# EAGLE design 06_SBCStage_v1 (EAGLE 9.6.2)

## Sheet 1 of 2
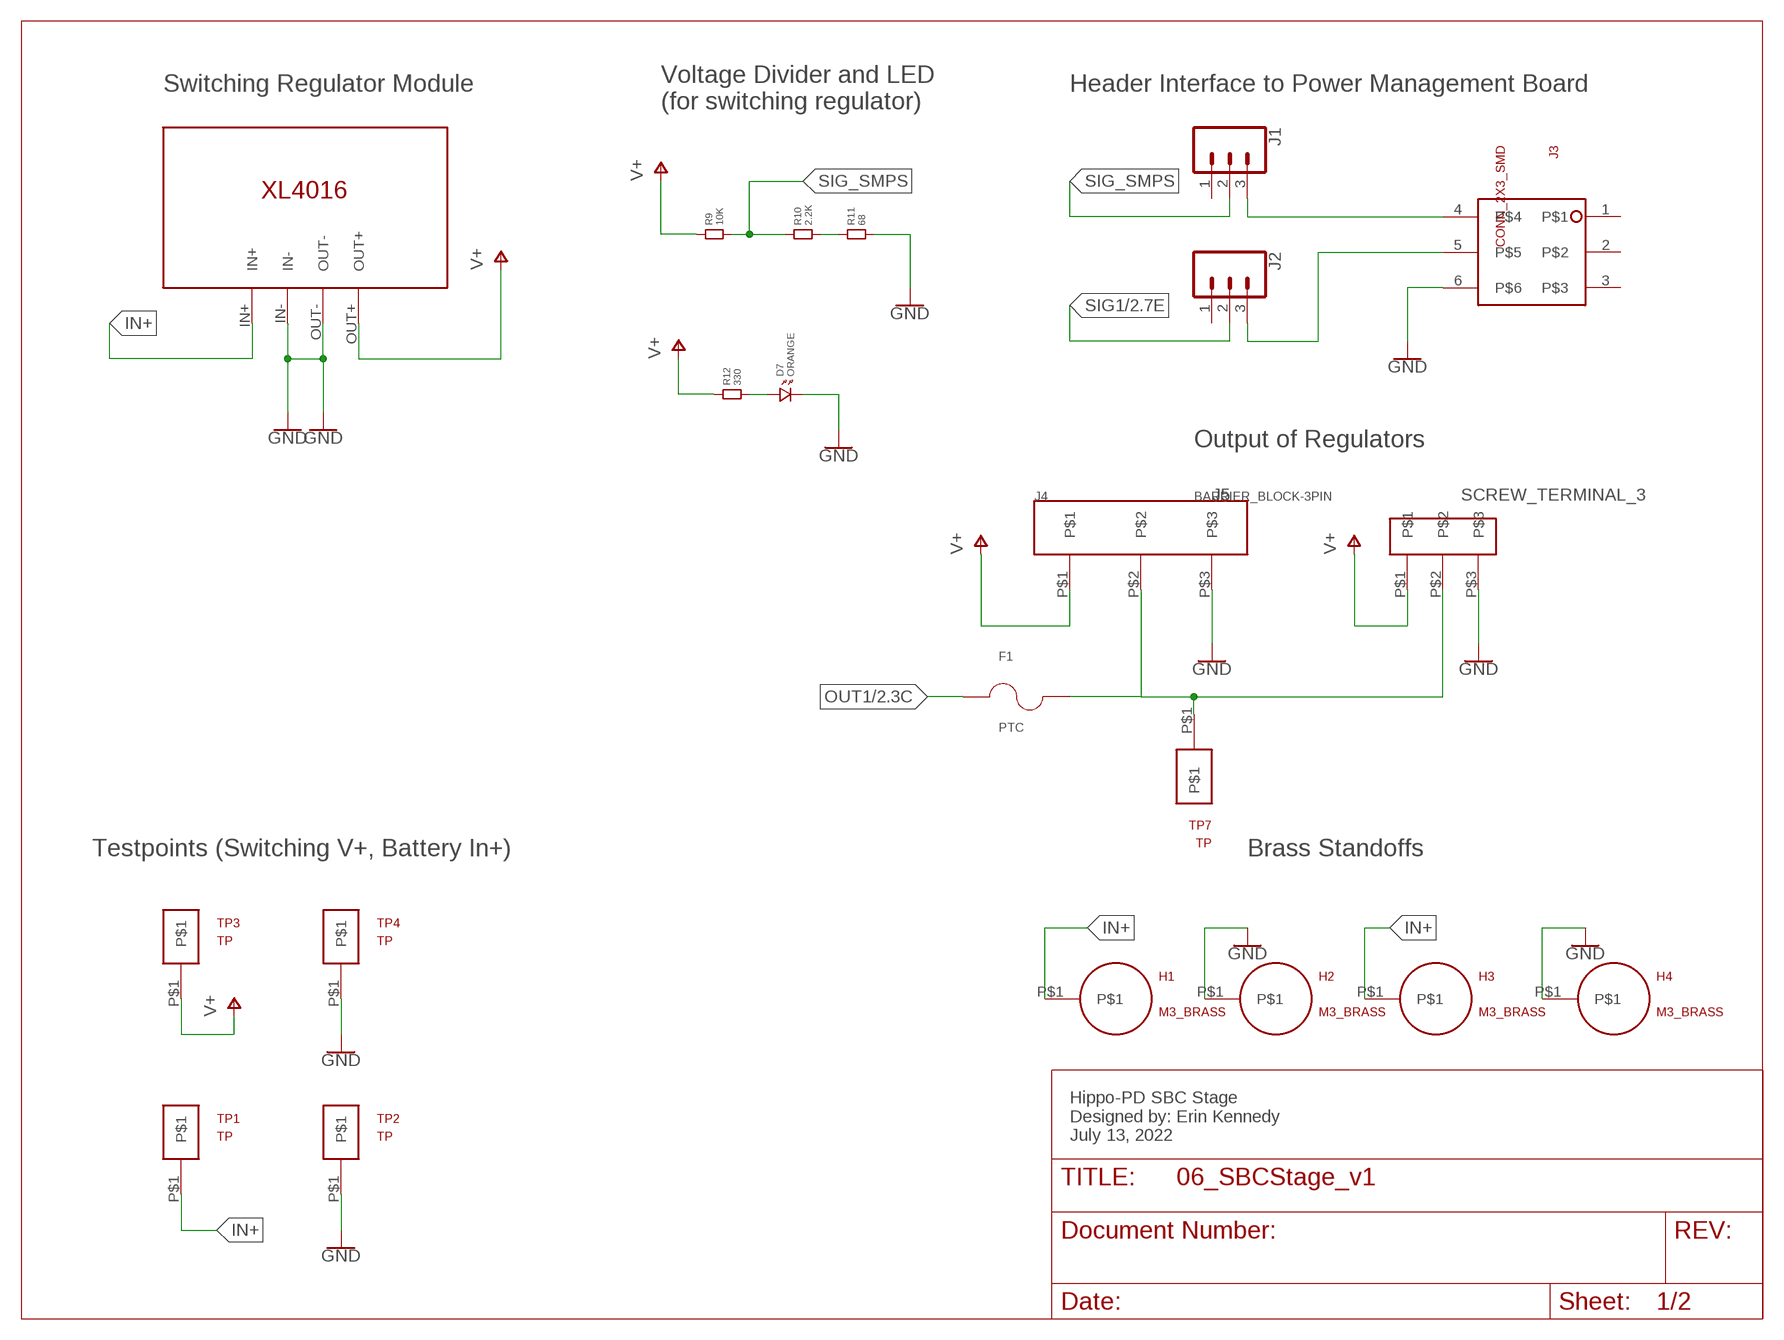
[diagram p0: schematic, sheet 1]

### Parts
D7  ORANGE  LED.1206  [1206.LED]
F1  PTC  [PTC]
H1  M3_BRASS  [M3_BRASS]
H2  M3_BRASS  [M3_BRASS]
H3  M3_BRASS  [M3_BRASS]
H4  M3_BRASS  [M3_BRASS]
J1  CONN_03  [1X03]
J2  CONN_03  [1X03]
J3  CONN_2X3_SMD  [2X3_SMD_CONNECTOR]
J4  BARRIER_BLOCK-3PIN  [BARRIERBLOCK-3PIN]
J5  SCREW_TERMINAL_3  [SCREW_TERM_3]
R9  10K  RESISTOR.1206  [1206]
R10  2.2K  RESISTOR.1206  [1206]
R11  68  RESISTOR.1206  [1206]
R12  330  RESISTOR.1206  [1206]
TP1  TP  [TP]
TP2  TP  [TP]
TP3  TP  [TP]
TP4  TP  [TP]
TP7  TP  [TP]
U1  XL4016-DEV  [XL4016-DEV]

### Nets
GND: D7.P$2 H2.P$1 H4.P$1 J3.6 J4.P$3 J5.P$3 R11.2 TP2.P$1 TP4.P$1 U1.IN- U1.OUT- ; also sheet 2
IN+: H1.P$1 H3.P$1 TP1.P$1 U1.IN+
N$1: D7.P$1 R12.2
N$2: F1.2 J4.P$2 J5.P$2 TP7.P$1
N$7: J2.3 J3.5
N$9: J1.3 J3.4
N$23: R10.2 R11.1
OUT1: F1.1 ; also sheet 2
SIG1: J2.2 ; also sheet 2
SIG_SMPS: J1.2 R9.2 R10.1
V+: J4.P$1 J5.P$1 R9.1 R12.1 TP3.P$1 U1.OUT+ ; also sheet 2
Unconnected: J1.1 J2.1 J3.1 J3.2 J3.3

### Notes on the sheet
- Switching Regulator Module | Header Interface to Power Management Board
- Voltage Divider and LED
  (for switching regulator)
- Output of Regulators
- Testpoints (Switching V+, Battery In+) | Brass Standoffs
- Hippo-PD SBC Stage
  Designed by: Erin Kennedy
  July 13, 2022

## Sheet 2 of 2
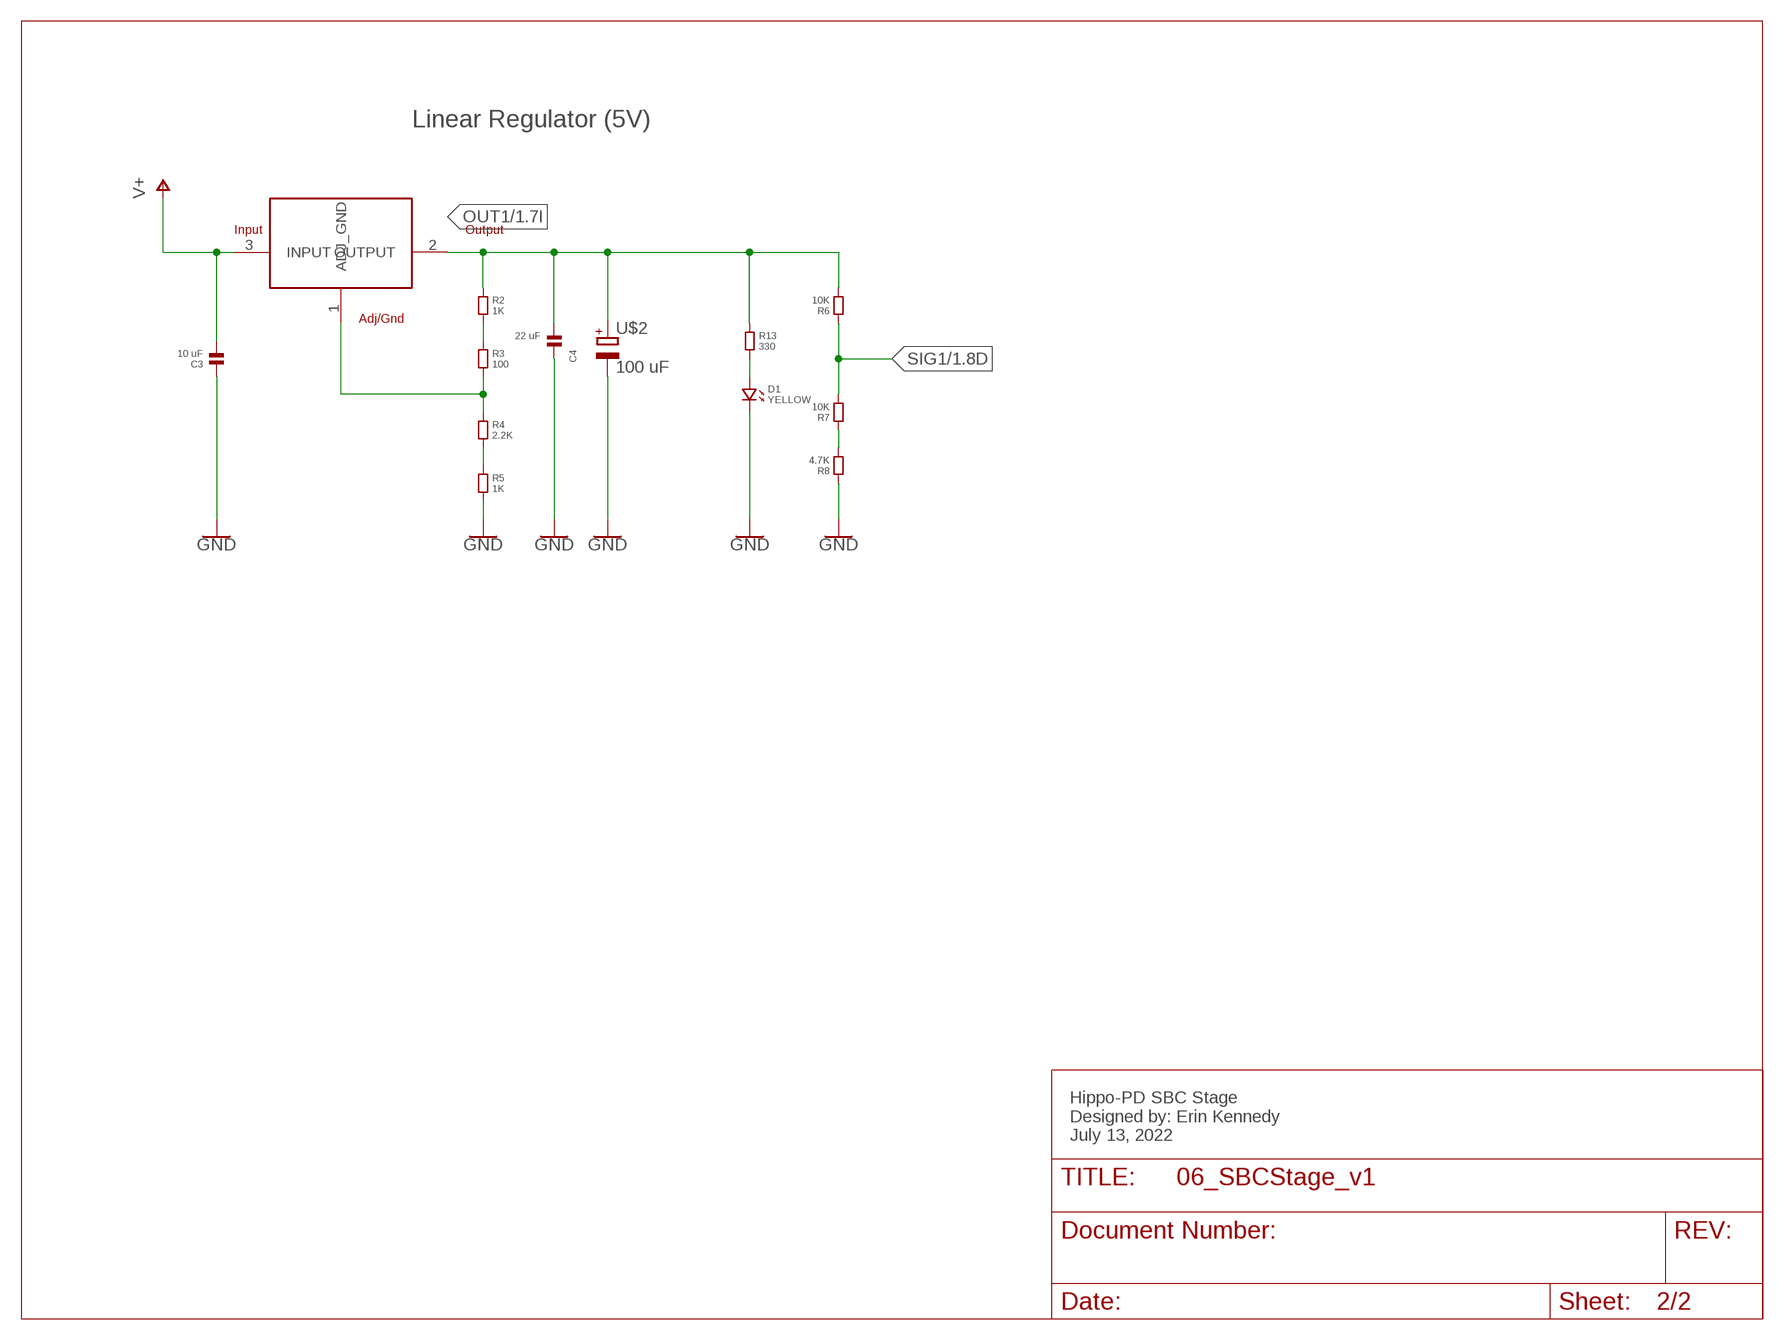
[diagram p1: schematic, sheet 2]

### Parts
C3  10 uF  CAPACITOR.1206  [1206]
C4  22 uF  CAPACITOR.1206  [1206]
D1  YELLOW  LED.1206  [1206.LED]
R1  AZ1084C  [AZ1084C]
R2  1K  RESISTOR.1206  [1206]
R3  100  RESISTOR.1206  [1206]
R4  2.2K  RESISTOR.1206  [1206]
R5  1K  RESISTOR.1206  [1206]
R6  10K  RESISTOR.1206  [1206]
R7  10K  RESISTOR.1206  [1206]
R8  4.7K  RESISTOR.1206  [1206]
R13  330  RESISTOR.1206  [1206]
U$2  100 uF  ELECTROLYTIC_CAP  [ELECTROLYTIC_CAP]

### Nets
GND: C3.1 C4.1 D1.P$2 R5.2 R8.1 U$2.- ; also sheet 1
N$3: D1.P$1 R13.2
N$4: R2.2 R3.1
N$5: R1.1(ADJ_GND) R3.2 R4.1
N$6: R4.2 R5.1
N$8: R7.1 R8.2
OUT1: C4.2 R1.2(OUTPUT) R2.1 R6.2 R13.1 U$2.+ ; also sheet 1
SIG1: R6.1 R7.2 ; also sheet 1
V+: C3.2 R1.3(INPUT) ; also sheet 1

### Notes on the sheet
- Linear Regulator (5V)
- Hippo-PD SBC Stage
  Designed by: Erin Kennedy
  July 13, 2022

## Library data of the parts
C3 C4 = standardparts:CAPACITOR
D1 D7 = standardparts:LED
F1 = Hippo-PS:PTC: PTC Resettable Fuse 0.75A(hold) 1.5A(trip) 60VDC 40A 1.5W 0.3s 0.18Ohm SMD Solder Pad 7.98 X 5.44 X 1.15mm T/R Check availability <https://pricing.snapeda.com/parts/0ZCF0075AF2C/Bel%20Fuse/view-part?ref=eda>; AVAILABILITY: In Stock; DESCRIPTION: 2920 SMT PPTC | 0.75 Ih | 603V; MF: Bel Fuse; MP: 0ZCF0075AF2C; PACKAGE: 2920 Bel Fuse; PRICE: None; PURCHASE-URL: https://pricing.snapeda.com/search/part/0ZCF0075AF2C/?ref=eda
H1-H4 = Hippo-PS:M3_BRASS
J1 J2 = SparkFun-Connectors:CONN_03: Multi connection point. Often used as Generic Header-pin footprint for 0.1 inch spaced/style header connections On any of the 0.1 inch spaced packages, you can populate with these: Break Away Headers - Straight <https://www.sparkfun.com/products/116> (PRT-00116) Break Away Male Headers - Right Angle <https://www.sparkfun.com/products/553> (PRT-00553) Female Headers <https://www.sparkfun.com/products/115> (PRT-00115) Break Away Headers - Machine Pin <https://www.sparkfun.com/products/117> (PRT-00117) Break Away Female Headers - Swiss Machine Pin <https://www.sparkfun.com/products/743> (PRT-00743) Stackable Header - 3 Pin (Female, 0.1") <https://www.sparkfun.com/products/13875> (PRT-13875) For SCREWTERMINALS and SPRING TERMINALS visit here: Screw Terimnals on SparkFun.com <https://www.sparkfun.com/search/results?term=Screw+Terminals> (5mm/3.5mm/2.54mm spacing) This device is also useful as a general connection point to wire up your design to another part of your project. Our various solder wires solder well into these plated through hole pads. Hook-Up Wire - Assortment (Stranded, 22 AWG) <https://www.sparkfun.com/products/11375> (PRT-11375) Hook-Up Wire - Assortment (Solid Core, 22 AWG) <https://www.sparkfun.com/products/11367> (PRT-11367) View the entire wire category on our website here <https://www.sparkfun.com/categories/141> Special notes: Molex polarized connector foot print use with SKU : PRT-08232 with associated crimp pins and housings.
J3 = Hippo-PS:CONN_2X3_SMD
J4 = Hippo-PS:BARRIER_BLOCK-3PIN: Barrier block connector Digikey #ED2946-ND
J5 = EK's Parts:SCREW_TERMINAL_3
R1 = Hippo-PS:AZ1084C
R2-R13 = standardparts:RESISTOR
TP1-TP4 TP7 = Hippo-PS:TP
U1 = Hippo-PS:XL4016-DEV
U$2 = Hippo-PS:ELECTROLYTIC_CAP: Check availability <https://pricing.snapeda.com/parts/865080545012/Wurth%20Electronics/view-part?ref=eda>; AVAILABILITY: In Stock; DESCRIPTION: 100 µF 35 V Aluminum Electrolytic Capacitors Radial, Can - SMD - 2000 Hrs @ 105°C; MF: Wurth Electronics; MP: 865080545012; PACKAGE: Radial Würth Elektronik; PRICE: None; PURCHASE-URL: https://pricing.snapeda.com/search/part/865080545012/?ref=eda

## Board
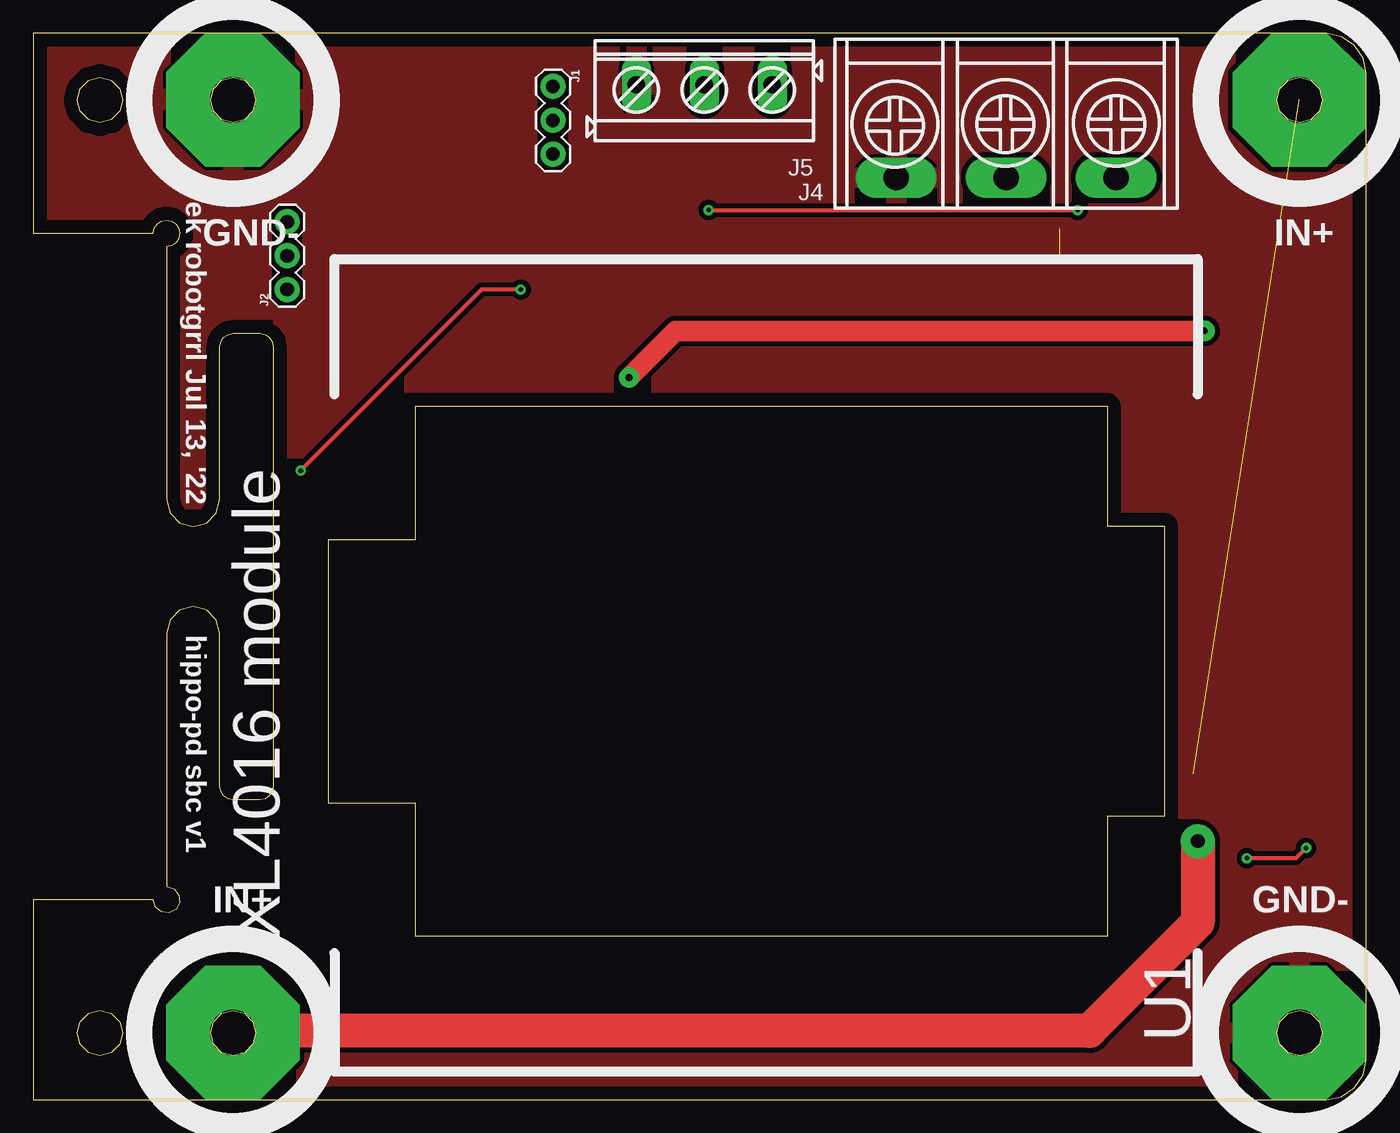
[diagram p2: board, top side]
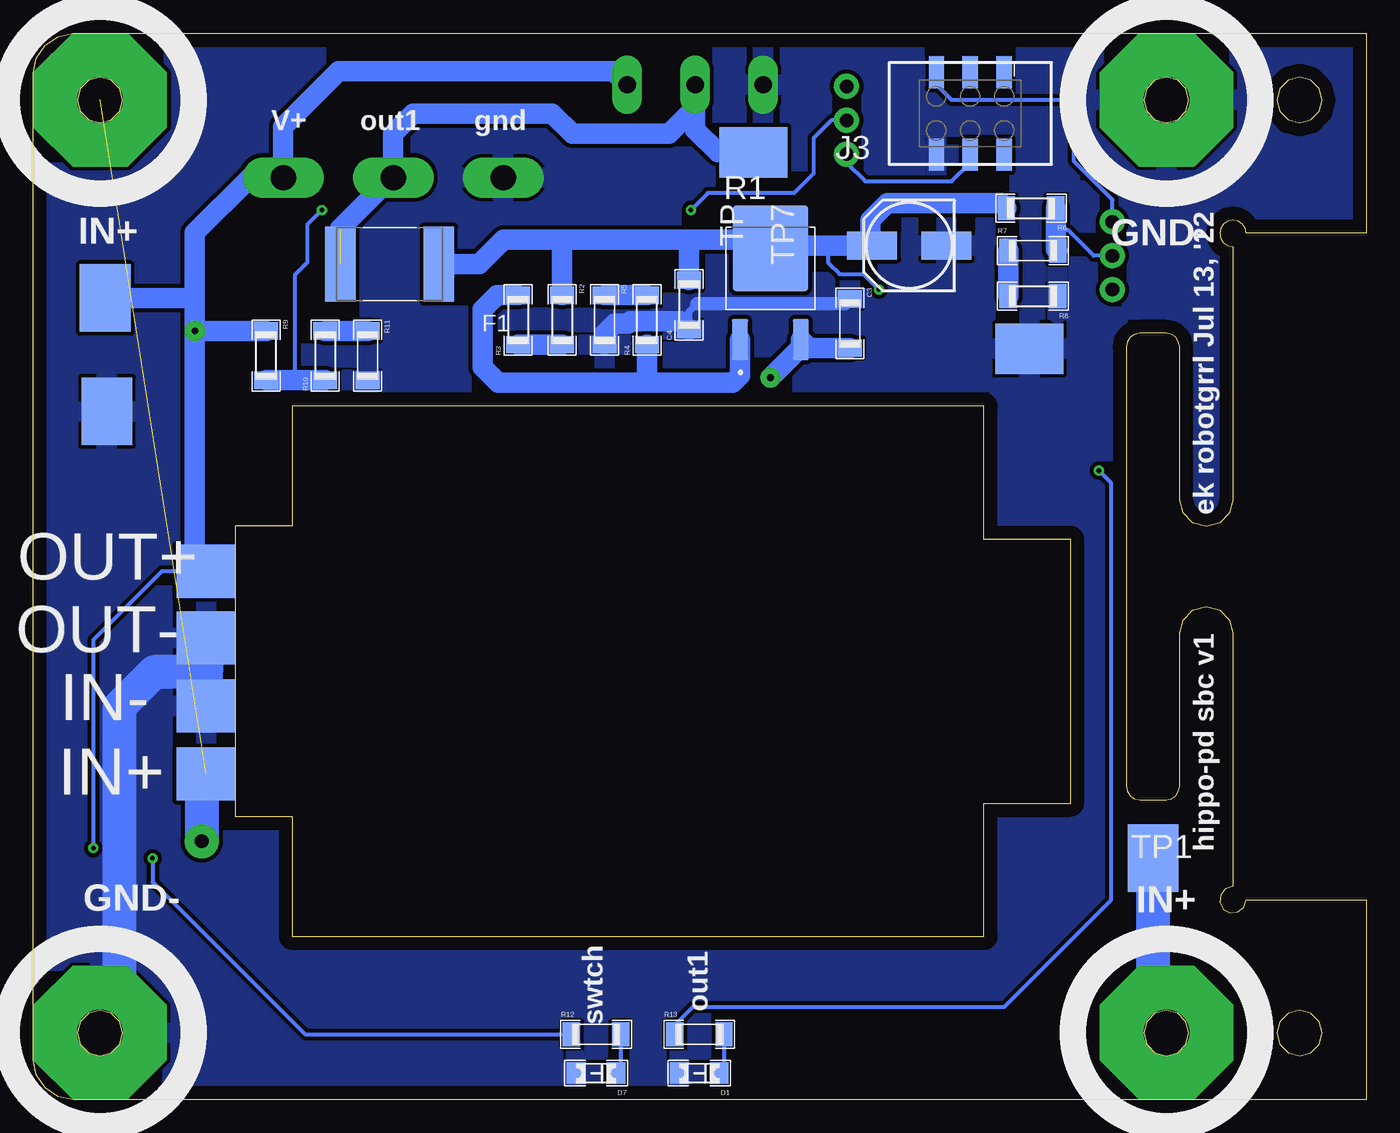
[diagram p3: board, bottom side, seen from below]

Size 100 x 80 mm. Coordinates in mm from the lower left corner, seen from the top.
Outline: 100,77 99.77,78.15 99.12,79.12 98.15,79.77 97,80 0,80 0,65 9,65 9.08,65.39 9.29,65.71 9.61,65.92 10,66 10.39,65.92 10.71,65.71 10.92,65.39 11,65 10.92,64.61 10.71,64.29 10.39,64.08 10,64 10,45 10.27,44 11,43.27 12,43 13,43.27 13.73,44 14,45 14,56.5 14.08,56.89 14.29,57.21 14.61,57.42 15,57.5 17,57.5 17.39,57.42 17.71,57.21 17.92,56.89 18,56.5 18,23.5 17.92,23.11 17.71,22.79 17.39,22.58 17,22.5 15,22.5 14.61,22.58 14.29,22.79 14.08,23.11 14,23.5 14,35 13.73,36 13,36.73 12,37 11,36.73 10.27,36 10,35 10,16 10.56,15.83 10.92,15.38 10.98,14.8 10.71,14.29 10.2,14.02 9.62,14.08 9.17,14.44 9,15 0,15 0,0 97,0 98.15,0.23 99.12,0.88 99.77,1.85 100,3 100,77
Outline: 6.7,75 6.47,74.15 5.85,73.53 5,73.3 4.15,73.53 3.53,74.15 3.3,75 3.53,75.85 4.15,76.47 5,76.7 5.85,76.47 6.47,75.85 6.7,75
Outline: 96.7,75 96.47,74.15 95.85,73.53 95,73.3 94.15,73.53 93.53,74.15 93.3,75 93.53,75.85 94.15,76.47 95,76.7 95.85,76.47 96.47,75.85 96.7,75
Outline: 96.7,5 96.47,4.15 95.85,3.53 95,3.3 94.15,3.53 93.53,4.15 93.3,5 93.53,5.85 94.15,6.47 95,6.7 95.85,6.47 96.47,5.85 96.7,5
Outline: 16.7,75 16.47,74.15 15.85,73.53 15,73.3 14.15,73.53 13.53,74.15 13.3,75 13.53,75.85 14.15,76.47 15,76.7 15.85,76.47 16.47,75.85 16.7,75
Outline: 16.7,5 16.47,4.15 15.85,3.53 15,3.3 14.15,3.53 13.53,4.15 13.3,5 13.53,5.85 14.15,6.47 15,6.7 15.85,6.47 16.47,5.85 16.7,5
Outline: 6.7,5 6.47,4.15 5.85,3.53 5,3.3 4.15,3.53 3.53,4.15 3.3,5 3.53,5.85 4.15,6.47 5,6.7 5.85,6.47 6.47,5.85 6.7,5
Copper layers (1*16): Top 0.035mm / dielectric 1.5mm / Bottom 0.035mm
Design rules "default *": minimum track width 8mil, minimum drill 0.35mm, track to track 10mil, track to pad 10mil, pad to pad 10mil, via to via 10mil, smd to smd 10mil, copper to edge 40mil, drill to drill 10mil, minimum pad ring 10mil, minimum via ring 8mil, stop-mask expansion 4mil, vias tented up to drill 0mil, thermal gap 10mil

### Footprints (pad centres in the part's own frame; a part is rotated, then mirrored left to right if it is on the bottom)
1206 = smd 1.3 x 1.8: 1 -1.85,0; 2 1.85,0
1206.LED = smd 1.4 x 1.6: P$1 -1.5,0; P$2 1.5,0
PTC = smd 2.3 x 5.6: 1 -3.7,0; 2 3.7,0
M3_BRASS = drill 3.4 pad 10 octagon: P$1 0,0
1X03 = drill 1.016 pad 1.88: 1 0,0; 2 2.54,0; 3 5.08,0
2X3_SMD_CONNECTOR = smd 1.147 x 2.408: 1 -2.54,-3.104; 2 -2.54,3.104; 3 0,-3.104; 4 0,3.104; 5 2.54,-3.104; 6 2.54,3.104
BARRIERBLOCK-3PIN = drill 1.905 pad 3.048 long: P$1 4.6,10.4; P$2 12.85,10.4; P$3 21.1,10.4
SCREW_TERM_3 = drill 1.3 pad 2.2 long: P$1 3.1,3.3; P$2 8.2,3.3; P$3 13.3,3.3
AZ1084C = smd 1.204 x 3.098: 1 -2.286,-4.26; 3 2.286,-4.26 | smd 5.63 x 6.448: 2 0,2.59
TP = smd 3.81 x 5.08: P$1 0,0
XL4016-DEV = smd 4 x 4.445 bottom: IN+ 10.9,0.334; IN- 16,0.334; OUT+ 26.1,0.334; OUT- 21.1,0.334
ELECTROLYTIC_CAP = smd 3.754 x 2.108: + 2.8,0; - -2.8,0

### Placement (x,y rotation side)
C3  38.73,58.25 270 bottom
C4  50.79,59.64 90 bottom
D1  50.03,1.98 180 bottom
D7  57.78,1.98 180 bottom
F1  73.27,62.69 180 bottom
H1  14.98,5.03 0 top
H2  94.99,5.03 0 top
H3  94.99,75.01 0 top
H4  14.98,75.01 0 top
J1  38.98,76.03 270 top
J2  19.04,60.79 90 top
J3  29.71,73.99 180 bottom
J4  85.84,79.58 180 top
J5  58.54,79.45 180 top
R1  44.7,61.29 0 bottom
R2  60.32,58.5 270 bottom
R3  63.62,58.5 90 bottom
R4  53.97,58.5 90 bottom
R5  57.14,58.5 270 bottom
R6  25.14,66.88 180 bottom
R7  25.01,63.71 0 bottom
R8  25.01,60.28 180 bottom
R9  82.54,55.83 270 bottom
R10  78.1,55.83 90 bottom
R11  74.92,55.83 270 bottom
R12  57.78,4.91 0 bottom
R13  50.03,4.91 0 bottom
TP1  15.99,18.11 0 bottom
TP2  94.48,51.64 0 bottom
TP3  94.61,60.15 0 bottom
TP4  25.27,56.34 90 bottom
TP7  45.97,71.07 270 bottom
U1  87.37,13.54 90 top
U$2  34.28,64.09 180 bottom

### Tracks (layer width: path | path; a pad name or v marks a point on that pad's centre or on a via)
GND
  Bottom 0.508: C4.1 50.79,59.13 50.21,59.71 | 39.11,59.71 C3.1
  Bottom 1.016: 50.21,59.71 39.11,59.71
  Bottom 1.524: C4.1 51.43,58.43 55.18,58.43 55.36,58.25 56.38,58.25 57.14,57.48 R5.2
  Bottom 2.54: U1.OUT- 87.03,32.08 | U1.IN- 87.03,32.08 | 87.03,32.08 90.92,32.08 93.51,29.49 93.51,6.51 H2.P$1
  pour Bottom (isolate 0.305): -4.58,85.93 -4.58,-5.51 107.18,-5.51 107.18,85.93
  pour Top (isolate 0.381): -4.58,87.84 -4.58,-5.51 107.18,-5.51 107.18,87.84
IN+  (via drill 1.02 pad 2.54)  (1 unrouted)
  Top 2.54: H1.P$1 15.11,5.16 79.24,5.16 87.37,13.29 v87.37,19.38
  Bottom 2.54: U1.IN+ 87.37,24.11 v87.37,19.38 | H1.P$1 15.99,6.05 TP1.P$1
N$1
  Bottom 0.305: R12.2 55.93,2.33 D7.P$1
N$2  (1 unrouted)
  Bottom 1.524: 76.97,65.36 73.15,69.18 J4.P$2 72.99,72.49 71.49,73.99 61.08,73.99 59.56,72.47 52.32,72.47 50.34,74.45 J5.P$2 50.34,72.78 48.63,71.07 TP7.P$1
N$3
  Bottom 0.305: R13.2 48.18,2.33 D1.P$1
N$4
  Bottom 1.524: R2.2 R3.1
N$5
  Bottom 1.524: R1.1 46.98,54.32 47.49,53.81 53.6,53.81 | 53.6,53.81 53.97,54.18 R4.1 | R3.2 65.2,60.35 66.29,59.26 66.29,54.96 65.14,53.81 53.6,53.81
N$6
  Bottom 1.524: R4.2 R5.1
N$7
  Bottom 0.305: J2.3 19.04,67.52 21.96,70.44 21.96,74.37 22.6,75.01 31.11,75.01 32.25,76.15 J3.5
N$8
  Bottom 1.524: R7.1 R8.2
N$9
  Bottom 0.305: J1.3 38.98,70.31 37.58,68.91 31.11,68.91 29.71,70.31 J3.4
N$23
  Bottom 1.524: R10.2 R11.1
OUT1  (via drill 0.35)
  Top 0.305: v36.57,60.79 33.65,60.79 v20.06,47.2
  Bottom 0.305: 40.38,64.09 40.38,62.82 39.49,61.93 37.71,61.93 v36.57,60.79 | R13.1 51.88,5.6 50.54,6.94 27.17,6.94 19.17,14.94 19.17,46.31 v20.06,47.2
  Bottom 1.524: 50.74,64.52 45.33,64.52 R1.2 44.49,64.09 40.38,64.09 U$2.+ 37.2,64.21 37.2,65.99 35.93,67.26 27.37,67.26 R6.2 | C4.2 50.79,64.47 50.74,64.52 | 60.32,64.52 R2.1 | 60.32,64.52 64.71,64.52 66.54,62.69 F1.1 | 50.74,64.52 60.32,64.52
SIG1
  Bottom 0.305: J2.2 20.44,63.33 22.34,65.23 23.29,65.23
  Bottom 1.524: R6.1 23.29,65.23 23.29,63.83 R7.2
SIG_SMPS  (via drill 0.35)
  Top 0.305: v50.67,66.75 v78.35,66.75
  Bottom 0.305: J1.2 40.12,73.49 41.46,72.15 41.46,69.49 42.92,68.02 49.4,68.02 v50.67,66.75 | 80.38,53.98 80.38,61.87 79.44,62.81 79.44,65.66 v78.35,66.75
  Bottom 1.524: R9.2 80.38,53.98 R10.1
V+  (via drill 0.35, 0.51 pad 1.52)
  Top 0.305: v95.5,18.88 94.73,18.11 v91.05,18.11
  Top 1.524: v87.88,57.68 48.2,57.68 v44.7,54.18
  Bottom 0.305: U1.OUT+ 90.35,39.64 95.5,34.5 v95.5,18.88 | v91.05,18.11 91.05,16.34 79.62,4.91 R12.1
  Bottom 1.524: C3.2 41.77,56.4 R1.3 42.41,56.47 v44.7,54.18 | U1.OUT+ 87.88,40.48 v87.88,57.68 | v87.88,57.68 87.88,60.15 TP3.P$1 | v87.88,57.68 R9.1 | v87.88,57.68 87.88,65.05 83.74,69.18 J4.P$1 81.24,73.01 77.08,77.17 56.45,77.17 J5.P$1

### Text on the board
tPlace: ek robotgrrl Jul 13, '22 | GND- | IN+ | hippo-pd sbc v1 | IN+ | GND-
bPlace: gnd | out1 | V+ | GND- | IN+ | ek robotgrrl Jul 13, '22 | + | hippo-pd sbc v1 | IN+ | GND- | swtch | out1
tNames: word